# Altium schematic sheet Main.SchDoc
size A4; SheetNumber: 1; SheetTotal: 7
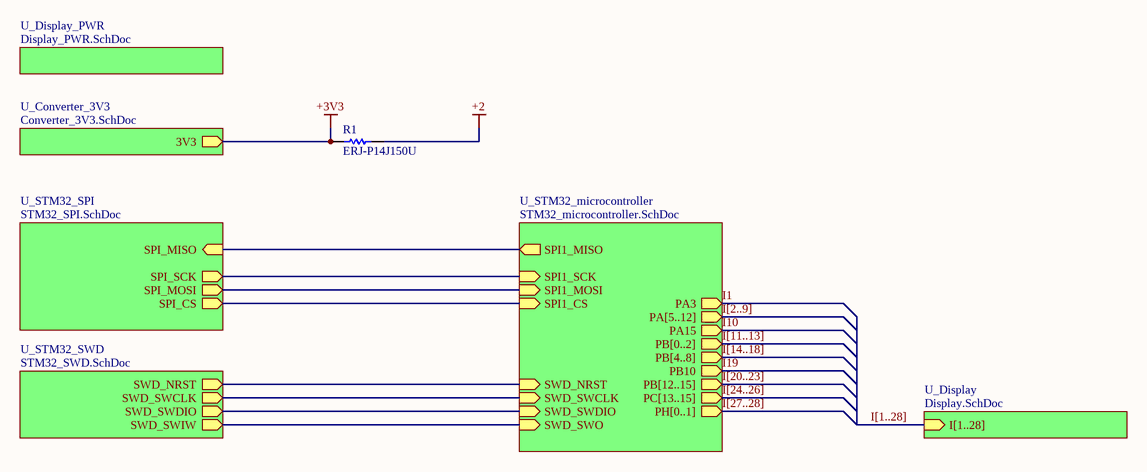
[diagram p0: Main.SchDoc]

## Parts
R1  ERJ-P14J150U  [RESC3225X70X50ML20T20]

## Sub-sheets
U_Converter_3V3 = Converter_3V3.SchDoc: 3V3 (out)
U_Display = Display.SchDoc: I[1..28] (in)
U_Display_PWR = Display_PWR.SchDoc: no entries
U_STM32_microcontroller = STM32_microcontroller.SchDoc: SPI1_SCK (in), SPI1_MOSI (in), SPI1_MISO (out), SPI1_CS (in), SWD_SWDIO (in), SWD_SWCLK (in), SWD_NRST (in), SWD_SWO (in), PA3 (out), PA[5..12] (out), PA15 (out), PB[0..2] (out), PB[4..8] (out), PB10 (out), PB[12..15] (out), PC[13..15] (out), PH[0..1] (out)
U_STM32_SPI = STM32_SPI.SchDoc: SPI_SCK (out), SPI_MOSI (out), SPI_CS (out), SPI_MISO (in)
U_STM32_SWD = STM32_SWD.SchDoc: SWD_NRST (out), SWD_SWCLK (out), SWD_SWDIO (out), SWD_SWIW (out)

## Nets
+2: R1.2
+3V3: R1.1 ; sheet U_Converter_3V3/3V3
I1: sheet U_STM32_microcontroller/PA3
I10: sheet U_STM32_microcontroller/PA15
I19: sheet U_STM32_microcontroller/PB10
(unnamed): sheet U_STM32_microcontroller/SPI1_SCK, sheet U_STM32_SPI/SPI_SCK
(unnamed): sheet U_STM32_microcontroller/SPI1_MOSI, sheet U_STM32_SPI/SPI_MOSI
(unnamed): sheet U_STM32_microcontroller/SPI1_MISO, sheet U_STM32_SPI/SPI_MISO
(unnamed): sheet U_STM32_microcontroller/SPI1_CS, sheet U_STM32_SPI/SPI_CS
(unnamed): sheet U_STM32_microcontroller/SWD_SWDIO, sheet U_STM32_SWD/SWD_SWDIO
(unnamed): sheet U_STM32_microcontroller/SWD_SWCLK, sheet U_STM32_SWD/SWD_SWCLK
(unnamed): sheet U_STM32_microcontroller/SWD_NRST, sheet U_STM32_SWD/SWD_NRST
(unnamed): sheet U_STM32_microcontroller/SWD_SWO, sheet U_STM32_SWD/SWD_SWIW

## Buses and harness runs
bus I[1..28] = sheet U_Display/I[1..28]
bus I[2..9] = sheet U_STM32_microcontroller/PA[5..12]
bus I[11..13] = sheet U_STM32_microcontroller/PB[0..2]
bus I[14..18] = sheet U_STM32_microcontroller/PB[4..8]
bus I[20..23] = sheet U_STM32_microcontroller/PB[12..15]
bus I[24..26] = sheet U_STM32_microcontroller/PC[13..15]
bus I[27..28] = sheet U_STM32_microcontroller/PH[0..1]

## Library data of the parts
R1 = CMP-2005-03662-1: Manufacturer: Panasonic; Part Number: ERJ-P14J150U